# Altium schematic sheet CPU_F107.schdoc
size 137 x 151 mm
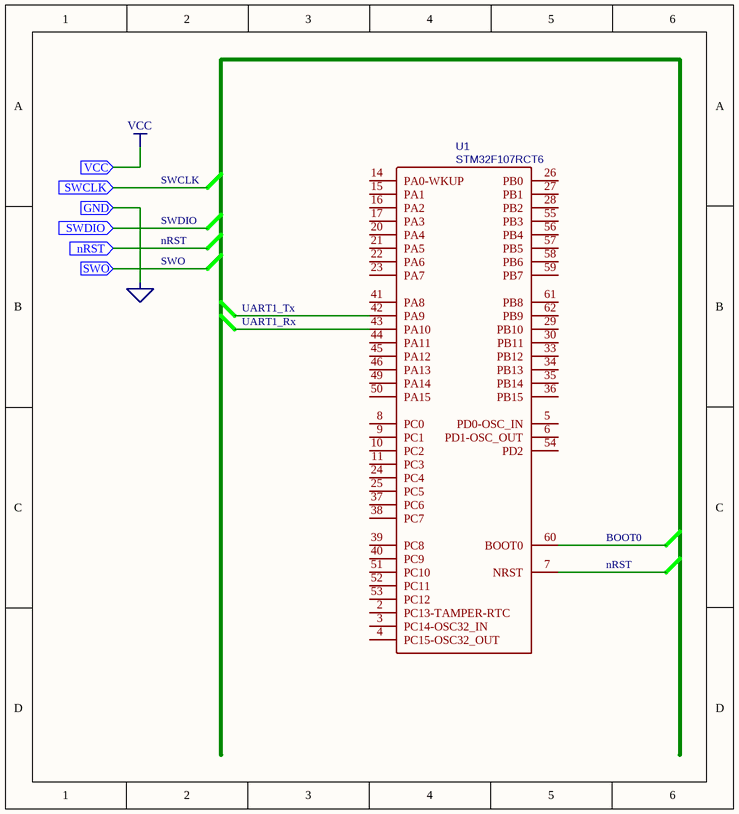
[diagram p0: CPU_F107.schdoc]

## Parts
U1  STM32F107RCT6  [LQFP-64_10X10X05P]

## Ports
GND, nRST, SWCLK, SWDIO, SWO, VCC

## Nets
GND: port GND
VCC: port VCC
BOOT0: U1.60(BOOT0)
nRST: U1.7(NRST) ; port nRST
SWCLK: port SWCLK
SWDIO: port SWDIO
SWO: port SWO
UART1_Rx: U1.43(PA10)
UART1_Tx: U1.42(PA9)

Not connected (* = marked no-connect by the designer): U1 2(PC13-TAMPER-RTC) 3(PC14-OSC32_IN) 4(PC15-OSC32_OUT) 5(PD0-OSC_IN) 6(PD1-OSC_OUT) 8(PC0) 9(PC1) 10(PC2) 11(PC3) 14(PA0-WKUP) 15(PA1) 16(PA2) 17(PA3) 20(PA4) 21(PA5) 22(PA6) 23(PA7) 24(PC4) 25(PC5) 26(PB0) 27(PB1) 28(PB2) 29(PB10) 30(PB11) 33(PB12) 34(PB13) 35(PB14) 36(PB15) 37(PC6) 38(PC7) 39(PC8) 40(PC9) 41(PA8) 44(PA11) 45(PA12) 46(PA13) 49(PA14) 50(PA15) 51(PC10) 52(PC11) 53(PC12) 54(PD2) 55(PB3) 56(PB4) 57(PB5) 58(PB6) 59(PB7) 61(PB8) 62(PB9)

## Library data of the parts
U1 = (no symbol name): BOM_Manufacturer: STMicroelectronics; BOM_Supplier: LCSC; BOM_Manufacturer Part: STM32F107RCT6; BOM_LCSC: C13643; image: //image.lceda.cn/szlcsc/C13643.jpg; spicePre: U